# EAGLE design TracesWithOrigin_V2 (EAGLE 5.10)
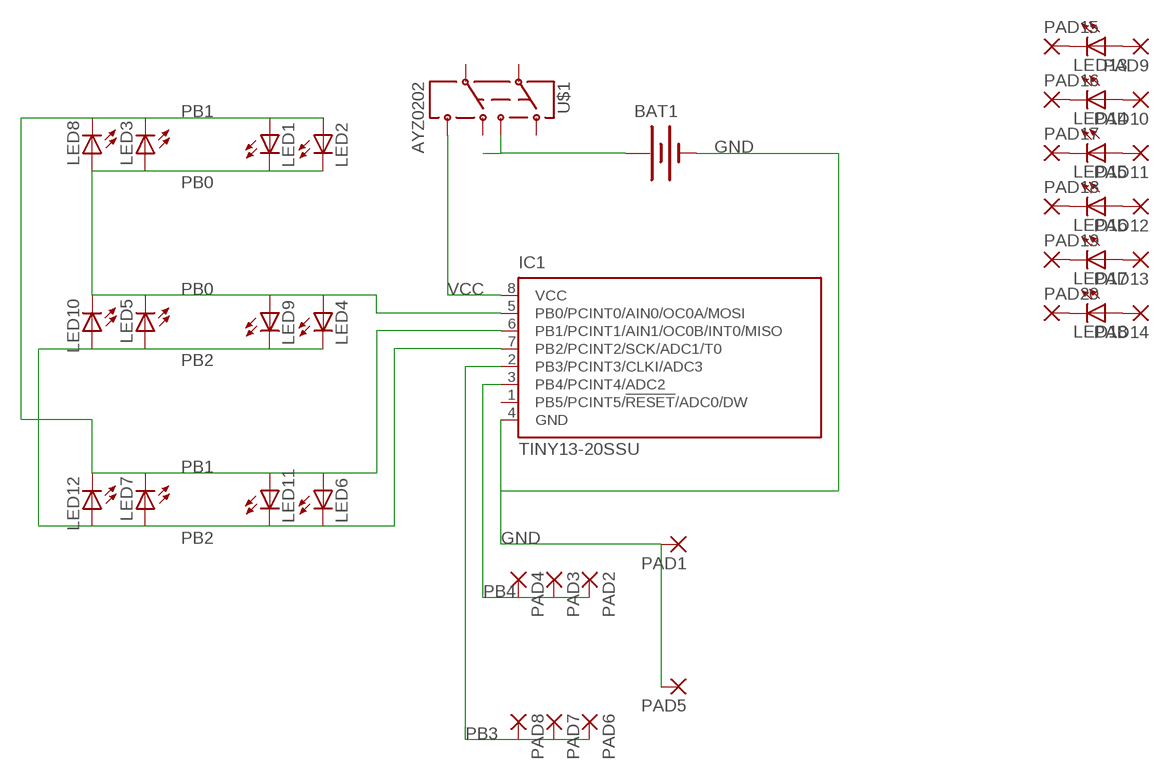
[diagram p0: schematic, sheet 1]

## Parts
BAT1  BATTERY245PTH  [BATTCON_245MM_PTH]
IC1  TINY13-20SSU  [8S1]
LED1  LED  [SMARTLED-TTW]
LED2  LED  [SMARTLED-TTW]
LED3  LED  [SMARTLED-TTW]
LED4  LED  [SMARTLED-TTW]
LED5  LED  [SMARTLED-TTW]
LED6  LED  [SMARTLED-TTW]
LED7  LED  [SMARTLED-TTW]
LED8  LED  [SMARTLED-TTW]
LED9  LED  [SMARTLED-TTW]
LED10  LED  [SMARTLED-TTW]
LED11  LED  [SMARTLED-TTW]
LED12  LED  [SMARTLED-TTW]
LED13  LED  [SMARTLED-TTW]
LED14  LED  [SMARTLED-TTW]
LED15  LED  [SMARTLED-TTW]
LED16  LED  [SMARTLED-TTW]
LED17  LED  [SMARTLED-TTW]
LED18  LED  [SMARTLED-TTW]
PAD1  3,81/1,4  [3,81/1,4]
PAD2  1,6/0,8  [1,6/0,8]
PAD3  1,6/0,8  [1,6/0,8]
PAD4  1,6/0,8  [1,6/0,8]
PAD5  3,81/1,4  [3,81/1,4]
PAD6  1,6/0,8  [1,6/0,8]
PAD7  1,6/0,8  [1,6/0,8]
PAD8  1,6/0,8  [1,6/0,8]
PAD9  1,6/0,8  [1,6/0,8]
PAD10  1,6/0,8  [1,6/0,8]
PAD11  1,6/0,8  [1,6/0,8]
PAD12  1,6/0,8  [1,6/0,8]
PAD13  1,6/0,8  [1,6/0,8]
PAD14  1,6/0,8  [1,6/0,8]
PAD15  1,6/0,8  [1,6/0,8]
PAD16  1,6/0,8  [1,6/0,8]
PAD17  1,6/0,8  [1,6/0,8]
PAD18  1,6/0,8  [1,6/0,8]
PAD19  1,6/0,8  [1,6/0,8]
PAD20  1,6/0,8  [1,6/0,8]
U$1  AYZ0202  [AYZ0202]

## Nets
GND: BAT1.2(-) IC1.4(GND) PAD1.1(P) PAD5.1(P)
N$2: BAT1.3(+) U$1.1
N$4: LED13.A@1(A) PAD9.1(P)
N$11: LED14.A@1(A) PAD10.1(P)
N$12: LED15.A@1(A) PAD11.1(P)
N$13: LED16.A@1(A) PAD12.1(P)
N$14: LED17.A@1(A) PAD13.1(P)
N$15: LED18.A@1(A) PAD14.1(P)
N$16: LED13.C@1(C) PAD15.1(P)
N$17: LED14.C@1(C) PAD16.1(P)
N$18: LED15.C@1(C) PAD17.1(P)
N$19: LED16.C@1(C) PAD18.1(P)
N$20: LED17.C@1(C) PAD19.1(P)
N$21: LED18.C@1(C) PAD20.1(P)
PB0: IC1.5(PB0/PCINT0/AIN0/OC0A/MOSI) LED1.C@1(C) LED2.C@1(C) LED3.A@1(A) LED4.A@1(A) LED5.C@1(C) LED8.A@1(A) LED9.A@1(A) LED10.C@1(C)
PB1: IC1.6(PB1/PCINT1/AIN1/OC0B/INT0/MISO) LED1.A@1(A) LED2.A@1(A) LED3.C@1(C) LED6.A@1(A) LED7.C@1(C) LED8.C@1(C) LED11.A@1(A) LED12.C@1(C)
PB2: IC1.7(PB2/PCINT2/SCK/ADC1/T0) LED4.C@1(C) LED5.A@1(A) LED6.C@1(C) LED7.A@1(A) LED9.C@1(C) LED10.A@1(A) LED11.C@1(C) LED12.A@1(A)
PB3: IC1.2(PB3/PCINT3/CLKI/ADC3) PAD6.1(P) PAD7.1(P) PAD8.1(P)
PB4: IC1.3(PB4/PCINT4/ADC2) PAD2.1(P) PAD3.1(P) PAD4.1(P)
VCC: IC1.8(VCC) U$1.4
Unconnected: IC1.1(PB5/PCINT5/!RESET!/ADC0/DW) U$1.2 U$1.3 U$1.5 U$1.6

## Library data of the parts
BAT1 = SparkFun:BATTERY: Battery Holders Various common sizes : AA, AAA, 20mm coin cell and 12mm coin cell.
IC1 = atmel:TINY13: 8-bit AVR Microcontroller with 1K Bytes In-System Programmable Flash Source: http://www.atmel.com/dyn/resources/prod_documents/2535S.pdf
LED1-LED18 = led:LED: LED OSRAM: - CHIPLED LG R971, LG N971, LY N971, LG Q971, LY Q971, LO R971, LY R971 LH N974, LH R974 LS Q976, LO Q976, LY Q976 LO Q996 - Hyper CHIPLED LW Q18S LB Q993, LB Q99A, LB R99A - SideLED LS A670, LO A670, LY A670, LG A670, LP A670 LB A673, LV A673, LT A673, LW A673 LH A674 LY A675 LS A676, LA A676, LO A676, LY A676, LW A676 LS A679, LY A679, LG A679 - Hyper Micro SIDELED® LS Y876, LA Y876, LO Y876, LY Y876 LT Y87S - SmartLED LW L88C, LW L88S LB L89C, LB L89S, LG L890 LS L89K, LO L89K, LY L89K LS L896, LA L896, LO L896, LY L896 - TOPLED LS T670, LO T670, LY T670, LG T670, LP T670 LSG T670, LSP T670, LSY T670, LOP T670, LYG T670 LG T671, LOG T671, LSG T671 LB T673, LV T673, LT T673, LW T673 LH T674 LS T676, LA T676, LO T676, LY T676, LB T676, LH T676, LSB T676, LW T676 LB T67C, LV T67C, LT T67C, LS T67K, LO T67K, LY T67K, LW E67C LS E67B, LA E67B, LO E67B, LY E67B, LB E67C, LV E67C, LT E67C LW T67C LS T679, LY T679, LG T679 LS T770, LO T770, LY T770, LG T770, LP T770 LB T773, LV T773, LT T773, LW T773 LH T774 LS E675, LA E675, LY E675, LS T675 LS T776, LA T776, LO T776, LY T776, LB T776 LHGB T686 LT T68C, LB T68C - Hyper Mini TOPLED® LB M676 - Mini TOPLED Santana® LG M470 LS M47K, LO M47K, LY M47K Source: http://www.osram.convergy.de LUXEON: - LUMILED® LXK2-PW12-R00, LXK2-PW12-S00, LXK2-PW14-U00, LXK2-PW14-V00 LXK2-PM12-R00, LXK2-PM12-S00, LXK2-PM14-U00 LXK2-PE12-Q00, LXK2-PE12-R00, LXK2-PE12-S00, LXK2-PE14-T00, LXK2-PE14-U00 LXK2-PB12-K00, LXK2-PB12-L00, LXK2-PB12-M00, LXK2-PB14-N00, LXK2-PB14-P00, LXK2-PB14-Q00 LXK2-PR12-L00, LXK2-PR12-M00, LXK2-PR14-Q00, LXK2-PR14-R00 LXK2-PD12-Q00, LXK2-PD12-R00, LXK2-PD12-S00 LXK2-PH12-R00, LXK2-PH12-S00 LXK2-PL12-P00, LXK2-PL12-Q00, LXK2-PL12-R00 Source: www.luxeon.com KINGBRIGHT: KA-3528ASYC Source: www.kingbright.com
PAD1 PAD5 = wirepad:3,81/1,4: THROUGH-HOLE PAD
PAD2-PAD4 PAD6-PAD20 = wirepad:1,6/0,8: THROUGH-HOLE PAD
U$1 = SparkFun:AYZ0202: SPDT Slide Switch Simple SMD single-pull double-throw slide switch. Good for less than 350mA power switch, switching UARTs between devices, etc. Spark Fun Electronics SKU : COM-00597

## Board
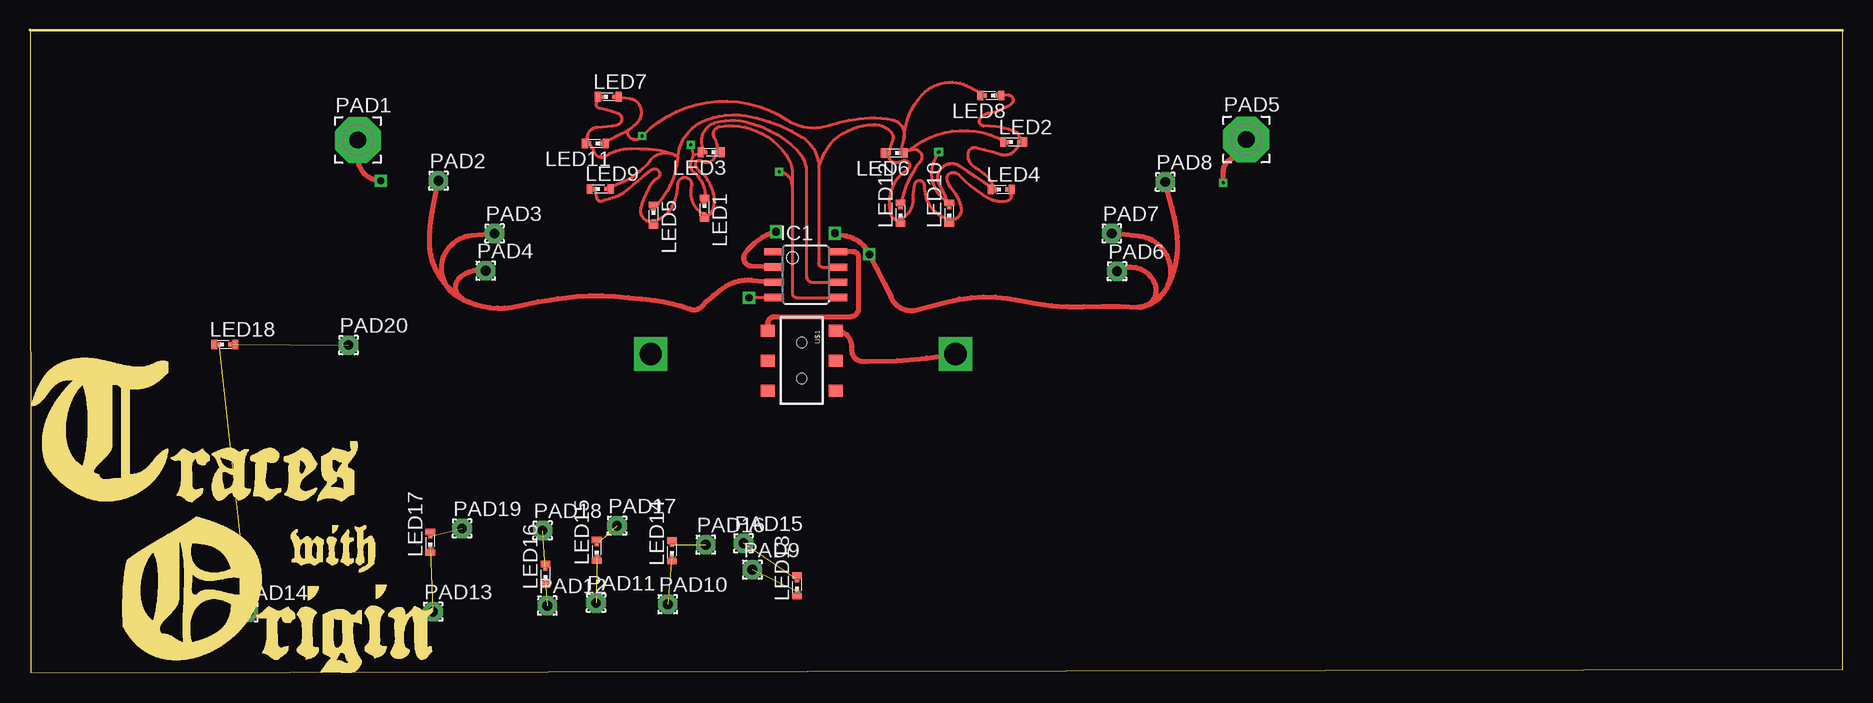
[diagram p1: board, top side]
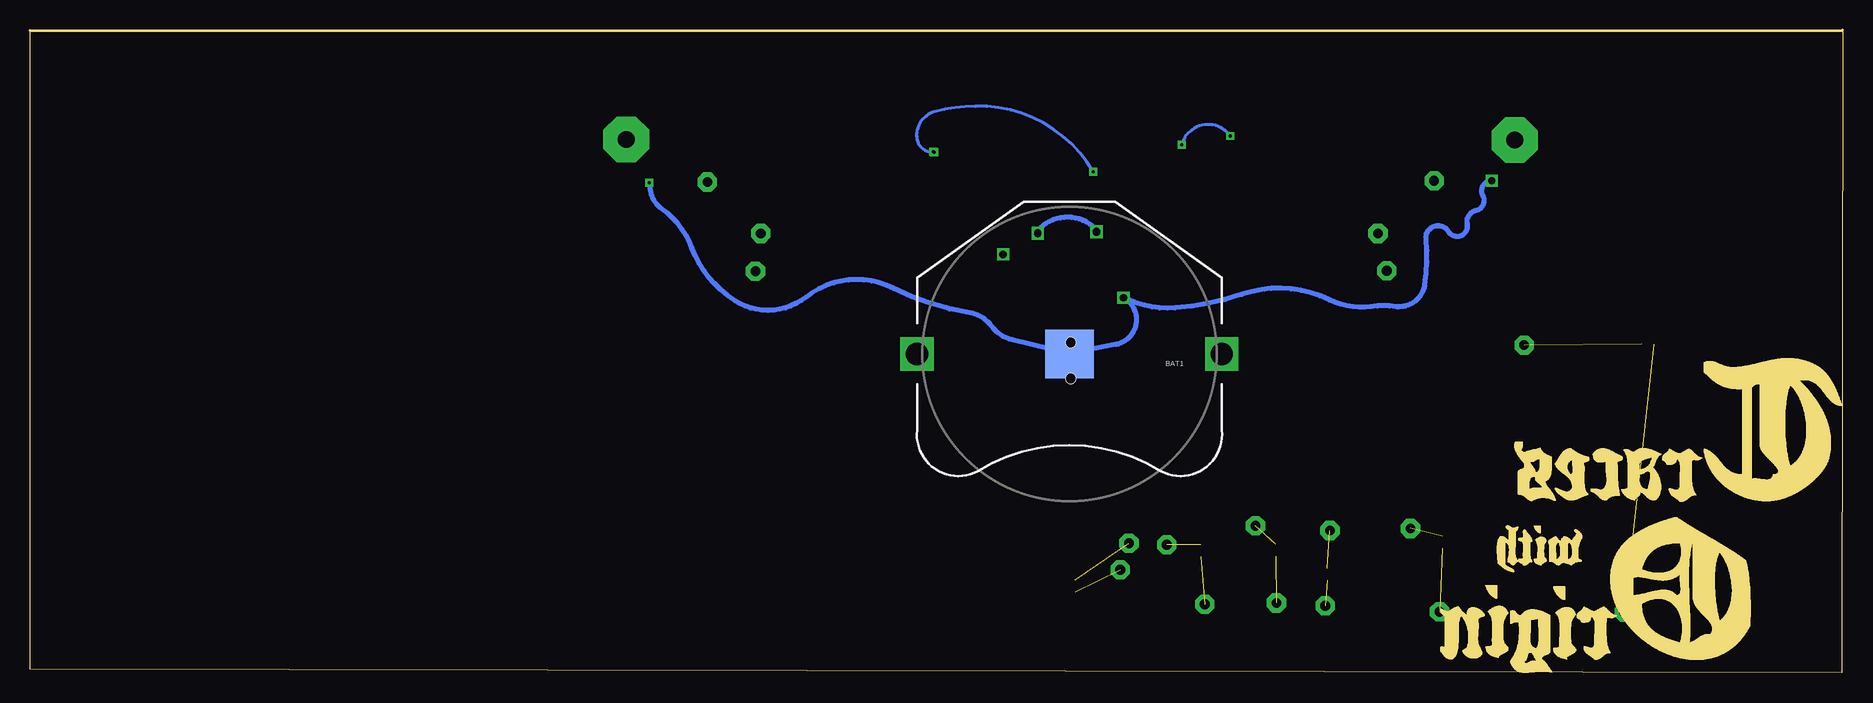
[diagram p2: board, bottom side, seen from below]

Size 151.04 x 53.56 mm. Coordinates in mm from the lower left corner, seen from the top.
Outline: 0.06,0 151.04,0.28 151.04,53.51 0,53.56 0.06,0
Copper layers (1*16): Top 0.035mm / dielectric 1.5mm / Bottom 0.035mm
Design rules "default": minimum track width 10mil, minimum drill 24mil, track to track 8mil, track to pad 8mil, pad to pad 8mil, via to via 8mil, smd to smd 8mil, copper to edge 40mil, drill to drill 8mil, minimum pad ring 10mil, minimum via ring 8mil, stop-mask expansion 4mil, vias tented up to drill 0mil, thermal gap 10mil
Milling: area 26.1,0 to 26.7,0; area 24.2,0 to 24.3,0.1; area 25.9,0 to 26.8,0.1; area 24.2,0.1 to 24.5,0.1; area 25.6,0.1 to 26.9,0.1; area 24.3,0.1 to 24.7,0.1; area 25.3,0.1 to 27,0.1; area 24.3,0.1 to 27,0.2; area 24.3,0.2 to 27.1,0.2; area 24.3,0.2 to 27.1,0.2; area 24.3,0.2 to 27.2,0.2; area 24.4,0.2 to 27.2,0.3; 5970 more areas

### Footprints (pad centres in the part's own frame; a part is rotated, then mirrored left to right if it is on the bottom)
BATTCON_245MM_PTH = drill 1.854 square: 1 -12.7,0; 3 12.7,0 | smd 4.064 x 4.064: 2 0,0
8S1 = smd 0.6 x 1.6: 1 -1.905,-2.654; 2 -0.645,-2.654; 3 0.625,-2.654; 4 1.895,-2.654; 5 1.905,2.654; 6 0.635,2.654; 7 -0.635,2.654; 8 -1.905,2.654
SMARTLED-TTW = smd 0.8 x 0.5: A 0,-0.875; C 0,0.875 | smd 0.35 x 0.35: A@1 0,-0.5; C@1 0,0.5
3,81/1,4 = drill 1.397 pad 3.81 octagon: 1 0,0
1,6/0,8 = drill 0.813 pad 1.6 octagon: 1 0,0
AYZ0202 = smd 1 x 1.15: 1 -2.5,2.825; 2 0,2.825; 3 2.5,2.825; 4 -2.5,-2.825; 5 0,-2.825; 6 2.5,-2.825 | hole 0.85: 1.5,0; -1.5,0

### Placement (x,y rotation side)
BAT1  64.43,26.57 180 bottom
IC1  64.65,33.17 270 top
LED1  56.19,38.69 180 top
LED2  81.96,44.22 270 top
LED3  56.76,43.37 90 top
LED4  80.95,40.27 270 top
LED5  51.96,38.13 180 top
LED6  72.04,43.32 90 top
LED7  48.19,48 270 top
LED8  80.05,48.11 90 top
LED9  47.51,40.33 270 top
LED10  76.61,38.3 0 top
LED11  47.12,44.11 90 top
LED12  72.55,38.3 0 top
LED13  63.92,7.23 0 top
LED14  53.49,10.16 0 top
LED15  47.23,10.22 0 top
LED16  42.94,8.19 0 top
LED17  33.36,10.89 0 top
LED18  16.21,27.36 270 top
PAD1  27.32,44.39 0 top
PAD2  34.03,41.01 0 top
PAD3  38.71,36.61 0 top
PAD4  37.98,33.51 0 top
PAD5  101.36,44.45 0 top
PAD6  90.59,33.45 0 top
PAD7  90.14,36.61 0 top
PAD8  94.59,40.89 0 top
PAD9  60.2,8.58 0 top
PAD10  53.15,5.71 0 top
PAD11  47.17,5.82 0 top
PAD12  43.11,5.59 0 top
PAD13  33.58,5.09 0 top
PAD14  18.19,5.03 0 top
PAD15  59.46,10.78 0 top
PAD16  56.31,10.67 0 top
PAD17  48.92,12.25 0 top
PAD18  42.72,11.85 0 top
PAD19  36.01,12.02 0 top
PAD20  26.53,27.3 0 top
U$1  64.31,26.01 270 top

### Tracks (layer width: path | path; a pad name or v marks a point on that pad's centre or on a via)
GND  (via drill 0.25 pad 0.25, 0.6)
  Top 0.254: v59.97,31.31 arc90 60.01,31.27 IC1.4
  Top 0.406: PAD1.1 27.32,42.92 arc90 v29.24,41.01 | PAD5.1 100.68,42.98 arc90 99.44,41.74 v99.44,40.84
  Bottom 0.406: v29.24,41.01 arc-119 29.97,39.77 arc107 30.54,38.52 arc-89 31.27,37.4 arc160 32.85,36.78 arc-154 34.71,36.16 arc15 34.82,32.32 arc89 37.25,30.52 arc-15 39.28,30.52 arc34 42.77,31.08 arc-45 50.05,31.53 arc15 55.63,30.4 arc31 v59.97,31.31 arc141 60.54,27.36 BAT1.2 69.22,27.75 arc40 70.91,28.88 arc-45 72.77,30.01 arc18 79.09,32.04 arc-65 86.36,31.31 arc71 92.34,31.02 arc37 95.89,35.42 arc-34 98.37,38.64 arc45 99.33,40.16 v99.44,40.84
N$1  (via drill 0.6)
  other vias: 59.92,31.25
N$2
  Top 0.406: U$1.1 arc-90 68.49,27.16 68.49,26.85 arc90 69.39,25.95 69.84,25.95 arc10 BAT1.3
N$3  (via drill 0.6)
  other vias: 29.24,41.01
N$4  (1 unrouted)
N$5  (via drill 0.6)
  other vias: 62.17,36.72
N$6  (via drill 0.6)
  other vias: 67.08,36.66
N$7  (via drill 0.25 pad 0.25)
  other vias: 55.07,43.99
N$8  (via drill 0.25 pad 0.25)
  other vias: 51.01,44.73
N$9  (via drill 0.25 pad 0.25)
  other vias: 99.44,40.84
N$10  (via drill 0.25 pad 0.25)
  other vias: 75.76,43.43
N$11  (1 unrouted)
N$12  (1 unrouted)
N$13  (1 unrouted)
N$14  (1 unrouted)
N$15  (1 unrouted)
N$16  (1 unrouted)
N$17  (1 unrouted)
N$18  (1 unrouted)
N$19  (1 unrouted)
N$20  (1 unrouted)
N$21  (1 unrouted)
PB0  (via drill 0.25 pad 0.25)
  Top 0.254: IC1.5 63.91,31.26 arc-90 63.52,31.65 63.52,40.5 | 63.52,40.5 63.52,41.68 arc29 63.24,42.75 arc70 57.49,45.52 arc111 57.04,44.56 arc-40 LED3.A@1 arc-50 56.76,42.64 arc-62 55.97,42.64 arc129 55.46,42.36 arc49 56.08,41.57 arc-24 56.7,40.61 arc-20 57.04,39.54 arc-26 56.87,38.52 arc-102 LED1.C@1 arc-80 55.12,40.55 arc71 54.9,41.17 arc122 53.99,40.72 arc-15 53.77,39.43 arc-30 52.98,38.19 arc-27 LED5.C@1 arc-40 51.4,37.68 arc-79 50.89,38.75 arc-21 51.85,40.84 arc-29 52.25,41.17 arc191 51.8,41.91 arc2 51.01,41.29 arc2 49.88,40.33 arc-26 48.52,39.6 arc6 47.68,39.31 arc-96 47.23,39.54 LED9.A@1 | LED8.A@1 81.57,48.11 arc-143 81.79,47.43 arc-29 79.88,46.64 arc59 79.14,46.08 arc113 79.48,45.57 arc-20 82.02,45.12 arc-87 LED2.C@1 arc-17 82.19,43.66 arc-72 80.89,43.2 arc3 78.86,43.77 arc95 78.18,43.32 arc70 78.81,42.08 arc-39 LED4.A@1 79.48,40.89 arc-2 77.45,42.25 arc57 76.38,42.36 arc98 75.82,40.67 arc-15 LED10.C@1 76.61,38.98 75.93,39.65 arc-85 75.76,43.37 arc80 75.76,43.49 arc227 v75.7,43.37 | 63.52,40.5 arc90 v62.45,41.74
  Bottom 0.254: v75.7,43.37 arc94 77.17,44.78 arc74 75.65,46.76 arc16 72.26,47.21 arc62 v62.45,41.74
PB1  (via drill 0.25 pad 0.25)
  Top 0.254: IC1.6 65.23,32.53 arc-90 64.71,33.05 64.71,41.68 arc44 63.98,43.49 arc33 59.63,45.91 arc28 57.15,45.85 arc110 LED3.C@1 55.29,43.15 | LED7.C@1 49.99,47.83 arc-117 50.78,46.08 arc-29 49.77,45.18 | 49.77,45.18 arc-2 LED11.A@1 arc-51 47.51,44.11 | v55.07,43.99 55.29,43.15 | 49.77,45.18 arc149 v51.01,44.73 arc-79 63.07,46.08 arc52 66.63,45.63 arc-16 69.95,46.25 arc-15 71.87,46.08 arc-91 72.83,44.56 | 72.83,44.56 LED6.A@1 73.27,43.53 | 73.27,43.53 73.5,43.6 arc-145 74.18,42.58 arc31 LED12.C@1 | LED8.C@1 78.35,48.79 arc77 74.35,48.17 arc40 72.83,44.56 | LED2.A@1 80.72,44.56 arc65 73.27,43.53 | 55.29,43.15 55.07,42.53 arc72 55.29,41.74 arc-65 LED1.A@1
  Bottom 0.254: v51.01,44.73 arc-130 v55.07,43.99
PB2
  Top 0.254: IC1.7 66.05,33.8 arc-90 65.72,34.13 65.72,42.13 | 65.72,42.13 arc57 64.37,44.61 arc24 59.63,46.42 arc30 56.36,46.08 arc64 53.99,42.98 | 53.99,42.98 arc-39 LED5.A@1 arc-274 LED5.A@1 | LED9.C@1 49.48,40.95 arc31 51.63,42.64 arc-91 53.99,42.98 | LED7.A@1 47.28,47.6 arc124 47.45,47.04 arc-10 49.03,46.59 arc-146 48.98,45.69 arc-12 47.28,45.46 arc124 LED11.C@1 arc-13 47.06,43.32 arc100 47.96,43.04 arc-33 50.1,43.66 arc-6 52.25,43.54 arc-24 53.99,42.98 | 65.72,42.13 66.12,43.09 arc-32 67.41,44.73 arc-34 70.29,45.69 arc-46 71.7,45.12 arc-67 71.87,44.28 arc7 LED6.C@1 arc102 72.09,42.53 arc29 72.72,42.64 arc-173 73.11,41.91 arc77 71.76,38.13 arc97 LED12.A@1 arc28 73.28,38.41 arc39 73.62,39.54 arc-16 73.73,40.72 arc-169 74.52,40.61 arc78 LED10.A@1 arc115 77.62,38.75 arc30 77,40.05 arc-23 76.44,41.06 arc-100 76.83,41.68 arc-55 77.45,41.46 arc20 79.93,39.54 arc38 81.4,39.31 arc153 LED4.C@1
PB3  (via drill 0.6)
  Top 0.406: IC1.2 60.08,33.9 arc-122 59.58,34.92 arc-40 v62.17,36.78 | 92.34,30.46 arc5 87.83,30.52 arc-14 82.41,31.02 arc27 76.49,30.91 73.9,30.24 arc-80 71.76,31.25 arc4 v69.95,34.86 arc54 68.09,36.38 v67.08,36.61 | 92.34,30.46 arc115 93.75,32.43 arc100 PAD6.1 | PAD7.1 92.39,36.38 arc-170 92.34,30.46 | PAD8.1 95.16,38.81 arc-10 95.61,36.33 arc-32 94.88,32.32 arc-55 92.34,30.46
  Bottom 0.406: v62.17,36.78 62.17,36.89 62.28,37 arc-94 67.08,36.83 arc-82 v67.08,36.61
PB4
  Top 0.406: IC1.3 60.14,32.72 arc37 58,32.21 arc16 55.97,30.52 arc-69 55.01,30.29 arc14 52.08,31.02 arc2 48.75,31.36 arc9 45.59,31.36 arc9 40.74,30.57 arc-41 36.06,31.14 | 36.06,31.14 arc-111 35.84,32.94 arc-54 PAD4.1 | PAD3.1 36.8,36.44 arc154 36.06,31.14 | PAD2.1 33.53,38.41 arc12 33.3,35.87 arc59 36.06,31.14
VCC
  Top 0.406: U$1.4 61.49,29.1 arc-90 62.06,29.67 68.37,29.67 arc90 69.05,30.35 69.05,34.63 arc90 68.6,35.08 67.32,35.08 arc90 IC1.8

### Text on the board
Milling: /Users/plusea/Desktop/13-Traces with Origin/typo/Traces with Origin_font.bmp
Measures: /Users/plusea/Desktop/13-Traces with Origin/typo/Traces with Origin_font.bmp